# EasyEDA Pro project 无刷电机驱动_6-80V_20A_V2.0(无刷驱动板4T2用).eprj, board SNR8503M_BLDC_SNLS_6-80V_20A_V2.0-J
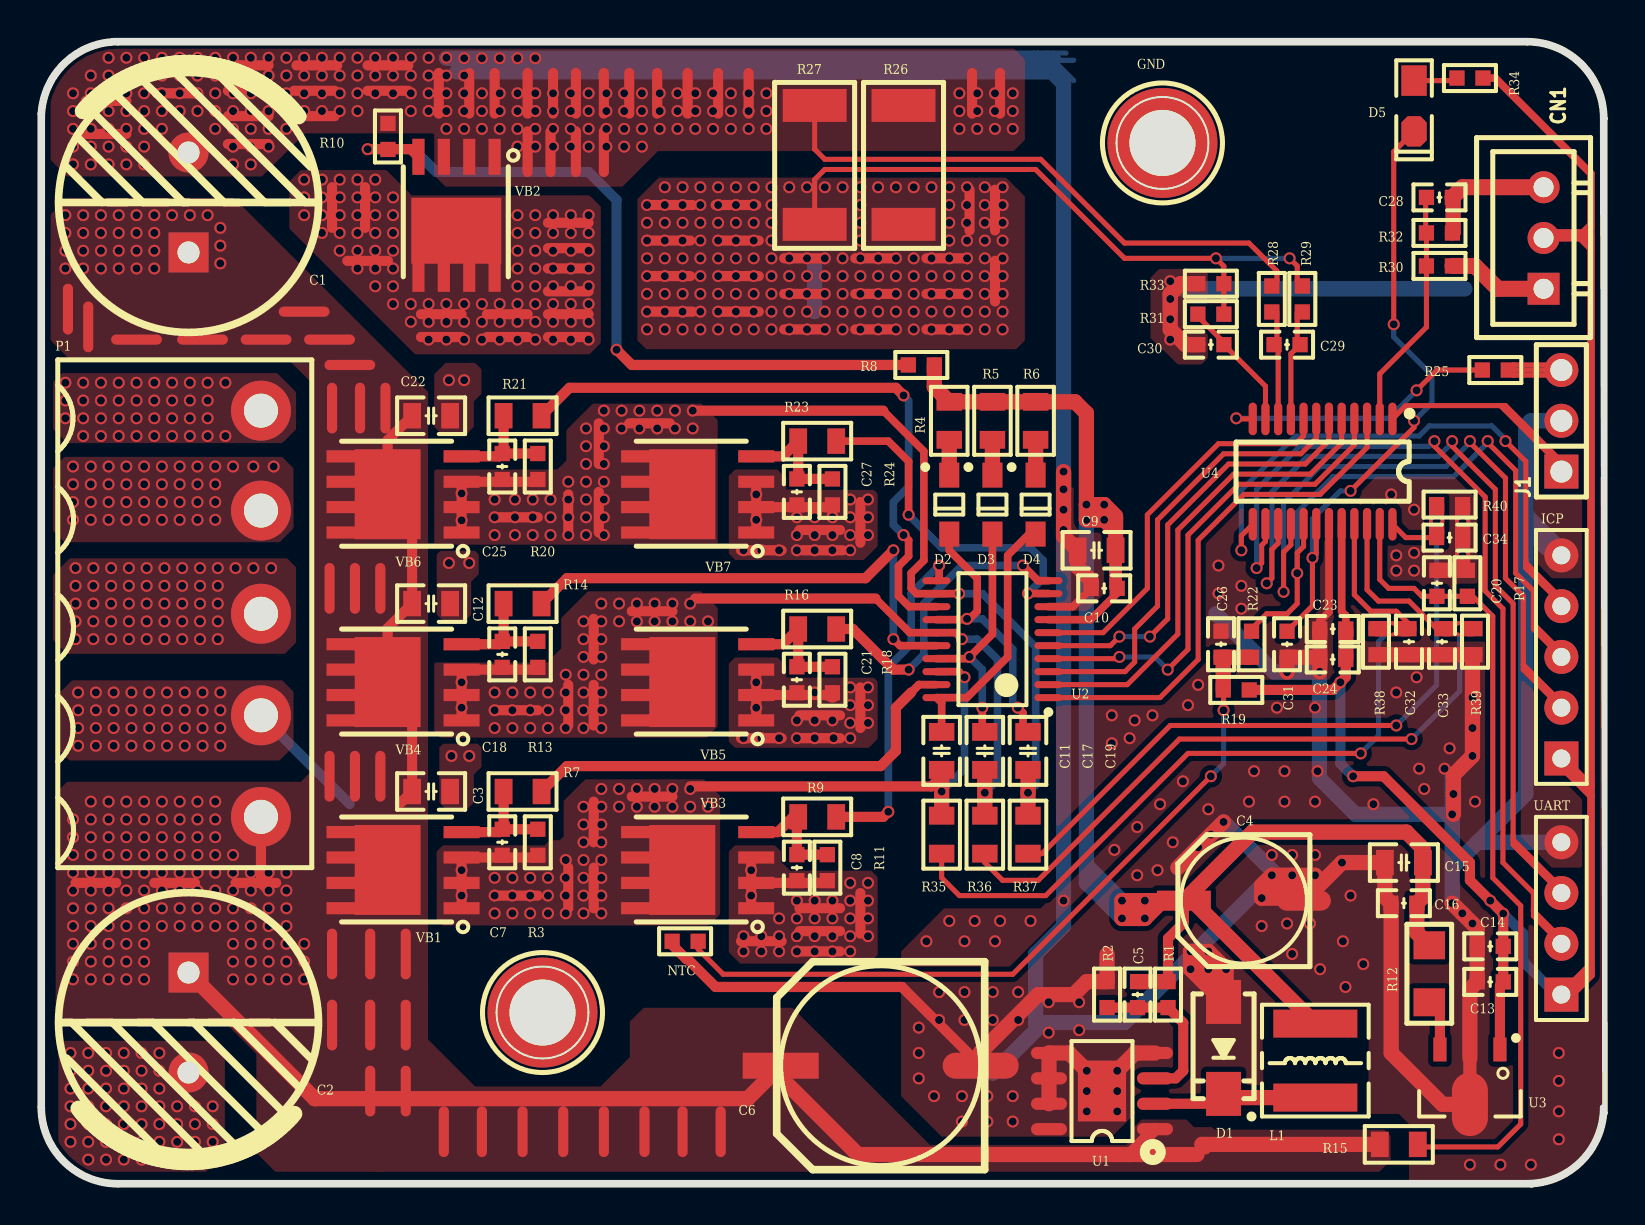
[diagram p0: board, top side]
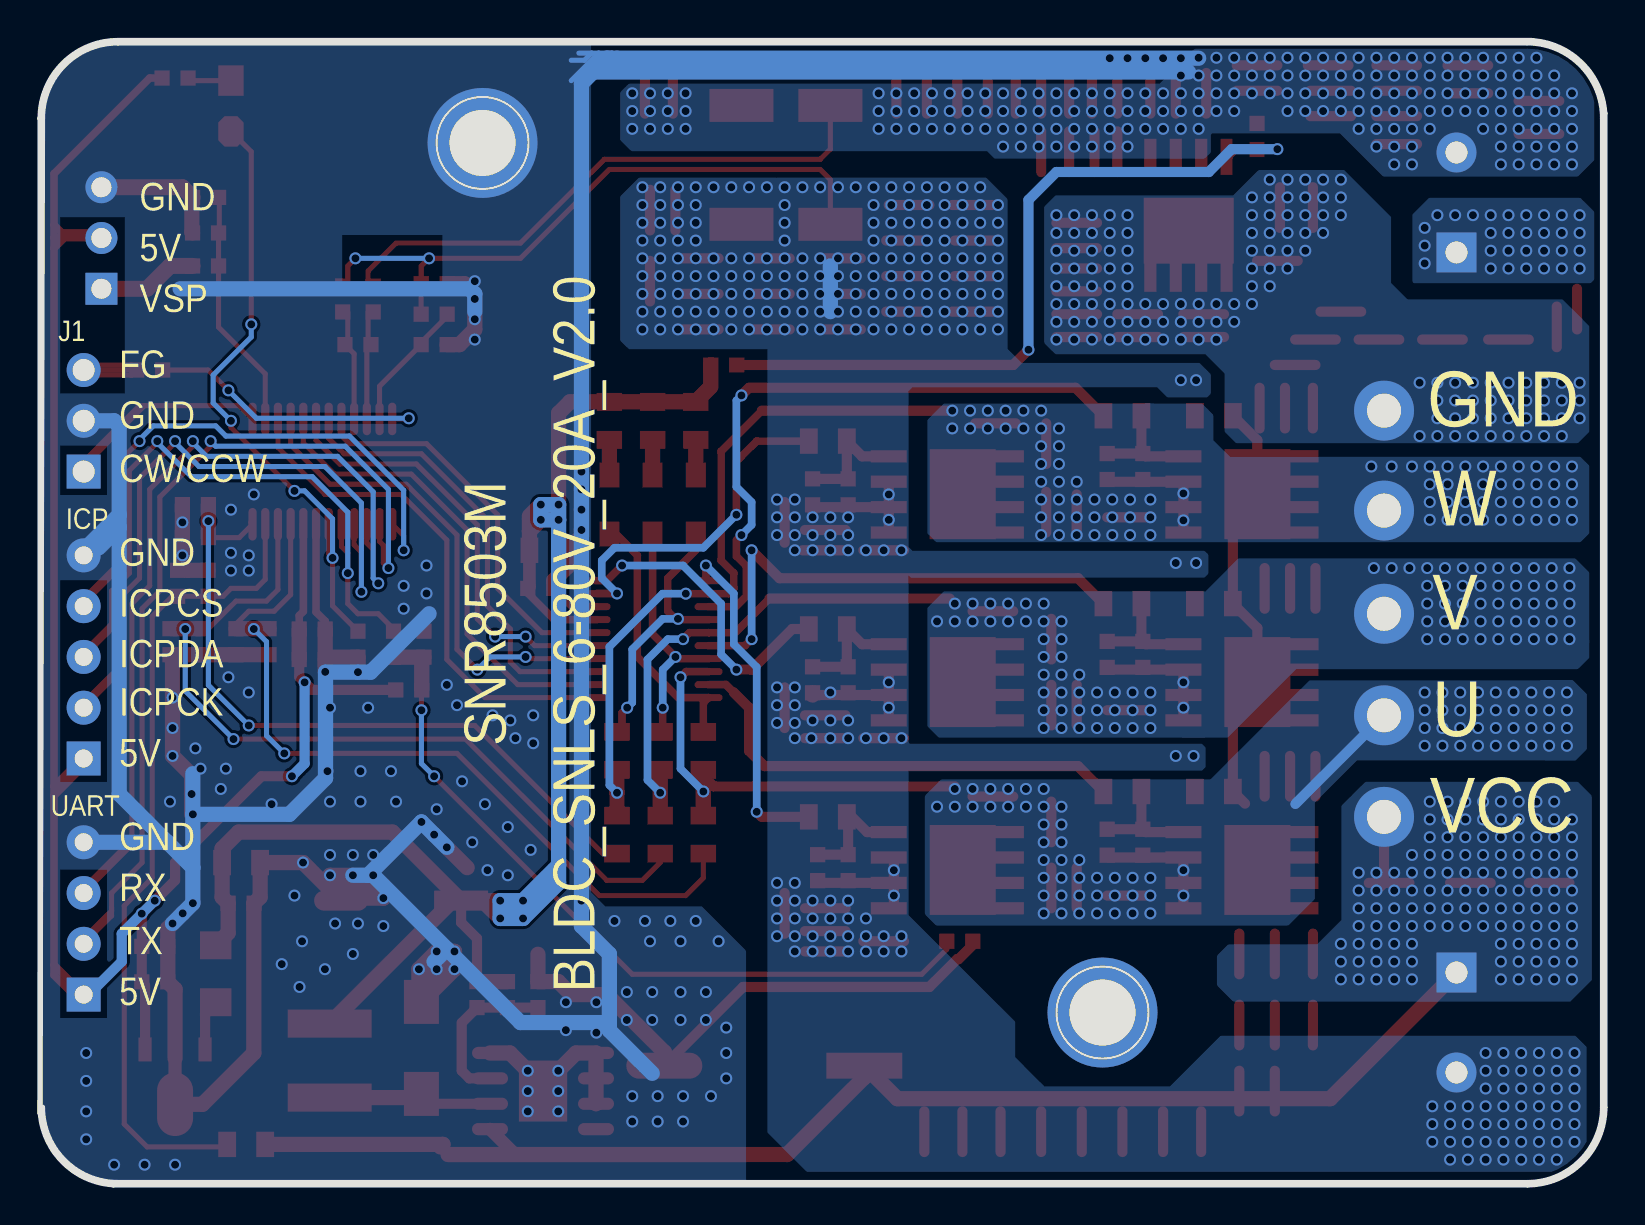
[diagram p1: board, bottom side, seen from below]

Outline 78.26 x 57.25 mm; copper layers: Top Layer, Bottom Layer. Coordinates in mm from the lower left corner of the outline.
Outline path: circle c25.13,8.63 r2.3 ; circle c56.13,52.13 r2.3 ; 74.57,0.13 3.89,0.13 arc(1.23,1.23) 0.13,3.89 0.13,53.36 arc(1.23,56.02) 3.89,57.13 74.36,57.13 arc(77.02,56.02) 78.13,53.36 78.25,3.61 ; 78.13,3.89 arc(77.02,1.23) 74.36,0.13 ; 78.25,53.35 arc(78.25,53.35) 78.25,53.34 ; 78.25,53.34 arc(78.26,53.35) 78.25,53.36 arc(77.11,56.11) 74.36,57.25 3.68,57.25 arc(3.66,57.25) 3.64,57.25 arc(1.15,56.12) 0.01,53.64 arc(0,53.62) 0,53.59 0,3.89 arc(1.14,1.14) 3.89,0 74.57,0 arc(74.6,0) 74.62,0.01 arc(77.08,1.11) 78.24,3.55 arc(78.25,3.58) 78.25,3.61 ; 78.25,53.34 78.25,3.61
Stack: Top Layer 0.0356mm / Dielectric1 0.32mm FR-4 er 4.8 / Bottom Layer 0.0356mm

## Design rules (mm)
net ICP: Inside Board Components
net R26: Inside Board Components
net R10: Inside Board Components
net R8: Inside Board Components
net R6: Inside Board Components
net R4: Inside Board Components
net D2: Inside Board Components
net C22: Inside Board Components
net C19: Inside Board Components
net C12: Inside Board Components
net VB7: Inside Board Components
net VB6: Inside Board Components
net VB5: Inside Board Components
net VB4: Inside Board Components
net VB3: Inside Board Components
net VB2: Inside Board Components
net VB1: Inside Board Components
net UART: Inside Board Components
net U4: Inside Board Components
net U3: Inside Board Components
net U1: Inside Board Components
net R40: Inside Board Components
net R39: Inside Board Components
net R38: Inside Board Components
net R37: Inside Board Components
net R36: Inside Board Components
net R35: Inside Board Components
net R34: Inside Board Components
net R33: Inside Board Components
net R32: Inside Board Components
net R31: Inside Board Components
net R30: Inside Board Components
net R29: Inside Board Components
net R28: Inside Board Components
net R27: Inside Board Components
net R25: Inside Board Components
net R24: Inside Board Components
net R23: Inside Board Components
net R22: Inside Board Components
net R21: Inside Board Components
net R20: Inside Board Components
net R19: Inside Board Components
net R18: Inside Board Components
net R17: Inside Board Components
net R16: Inside Board Components
net R15: Inside Board Components
net R14: Inside Board Components
net R13: Inside Board Components
net R12: Inside Board Components
net R11: Inside Board Components
net R9: Inside Board Components
net R5: Inside Board Components
net R7: Inside Board Components
net R3: Inside Board Components
net R2: Inside Board Components
net R1: Inside Board Components
net P1: Inside Board Components
net NTC: Inside Board Components
net L1: Inside Board Components
net J1: Inside Board Components
net HOLD1: Inside Board Components
net D5: Inside Board Components
net D1: Inside Board Components
net C34: Inside Board Components
net C33: Inside Board Components
net C32: Inside Board Components
net C31: Inside Board Components
net C30: Inside Board Components
net C29: Inside Board Components
net C28: Inside Board Components
net C27: Inside Board Components
net C26: Inside Board Components
net C25: Inside Board Components
net C24: Inside Board Components
net C23: Inside Board Components
net C21: Inside Board Components
net C20: Inside Board Components
net C18: Inside Board Components
net C16: Inside Board Components
net C15: Inside Board Components
net C14: Inside Board Components
net C13: Inside Board Components
net C11: Inside Board Components
net C8: Inside Board Components
net C7: Inside Board Components
net C10: Inside Board Components
net C6: Inside Board Components
net C5: Inside Board Components
net C4: Inside Board Components
net C3: Inside Board Components
net C2: Inside Board Components
net C1: Inside Board Components
net HOLD2: Inside Board Components
net C9: Inside Board Components
net C17: Inside Board Components
net D3: Inside Board Components
net D4: Inside Board Components
net U2: Inside Board Components
net Q3: SNR8503M_BLDC_SNLS_6-80V_20A_V2.0
net FB3: SNR8503M_BLDC_SNLS_6-80V_20A_V2.0
net P4: SNR8503M_BLDC_SNLS_6-80V_20A_V2.0
net P5: SNR8503M_BLDC_SNLS_6-80V_20A_V2.0
net Q1: SNR8503M_BLDC_SNLS_6-80V_20A_V2.0
net Q2: SNR8503M_BLDC_SNLS_6-80V_20A_V2.0
net Q4: SNR8503M_BLDC_SNLS_6-80V_20A_V2.0
net Q5: SNR8503M_BLDC_SNLS_6-80V_20A_V2.0
net R43: SNR8503M_BLDC_SNLS_6-80V_20A_V2.0
net R44: SNR8503M_BLDC_SNLS_6-80V_20A_V2.0
net USR1: SNR8503M_BLDC_SNLS_6-80V_20A_V2.0
net R45: SNR8503M_BLDC_SNLS_6-80V_20A_V2.0
net C35: SNR8503M_BLDC_SNLS_6-80V_20A_V2.0
net U5: SNR8503M_BLDC_SNLS_6-80V_20A_V2.0
net SWD: SNR8503M_BLDC_SNLS_6-80V_20A_V2.0
net PG: SNR8503M_BLDC_SNLS_6-80V_20A_V2.0
template: 用户自定义配置
spacing Clearance (default): track to track 0.254, other pairs 0 to 0.254
track width Width (default): min 0.254, default 0.3, max 100
differential pair DiffPairsRouting (default): width min 0.381, default 0.381, max 0.381; gap min 0.254, default 0.701
via RoutingVias (default): diameter min 0.254, default 1.27, max 2.54; hole min 0.254, default 0.711, max 2.54

## Placement (name value [footprint] x y rotation side)
C1  220uF/100V  [CAP 5.0*12.5*20]  7.43 49.15 90 top
C2  220uF/100V  [CAP 5.0*12.5*20]  7.43 8.13 270 top
C3  0.1uF/100V/0805  [C 0805_L]  19.56 19.69 180 top
C4  100uF/35V  [CM D(6.3*7.7)]  60.2 14.22 180 top
C5  33nF/50V  [C 0603_L]  54.88 9.53 90 top
C6  33uF/100V  [CM F(10*10.2)]  42.04 5.97 180 top
C7  1nF/50V  [C 0603_L]  23.11 17.15 90 top
C8  1nF/50V  [C 0603_L]  37.85 15.88 90 top
C9  10uF/25V/0805  [C 0805_L]  52.83 31.75 0 top
C10  0.1uF/50V  [C 0603_L]  53.21 29.85 0 top
C11  10uF/25V/0805  [C 0805_L]  45.09 21.72 270 top
C12  0.1uF/100V/0805  [C 0805_L]  19.56 29.08 180 top
C13  10uF/10V  [C 0603_L]  72.52 10.16 0 top
C14  0.1uF/50V  [C 0603_L]  72.52 11.94 0 top
C15  10uF/25V/0805  [C 0805_L]  68.2 16.13 0 top
C16  0.1uF/50V  [C 0603_L]  68.2 14.1 0 top
C17  10uF/25V/0805  [C 0805_L]  47.24 21.72 270 top
C18  1nF/50V  [C 0603_L]  23.11 26.54 90 top
C19  10uF/25V/0805  [C 0805_L]  49.4 21.72 270 top
C20  0.1uF/50V  [C 0603_L]  69.85 30.1 270 top
C21  1nF/50V  [C 0603_L]  37.85 25.27 90 top
C22  0.1uF/100V/0805  [C 0805_L]  19.56 38.48 180 top
C23  0.1uF/50V  [C 0603_L]  64.64 27.81 0 top
C24  10uF/10V  [C 0603_L]  64.64 26.29 0 top
C25  1nF/50V  [C 0603_L]  23.11 35.94 90 top
C26  0.1uF/50V  [C 0603_L]  59.06 27.05 270 top
C27  1nF/50V  [C 0603_L]  37.85 34.67 90 top
C28  10uF/10V  [C 0603_L]  69.98 49.4 180 top
C29  1uF/16V  [C 0603_L]  62.36 42.04 180 top
C30  1nF/50V  [C 0603_L]  58.55 42.04 0 top
C31  0.1uF/50V  [C 0603_L]  62.36 27.05 90 top
C32  1nF/50V  [C 0603_L]  68.45 27.18 90 top
C33  1nF/50V  [C 0603_L]  70.1 27.18 90 top
C34  1nF/50V  [C 0603_L]  70.49 32.39 180 top
CN1  ZX-XH2.54-3PZZ  [CONN-TH_3P-P2.54_2501S-3P]  75.18 47.37 90 top
D1  SS210  [SMA]  59.18 6.86 270 top
D2  US1M  [SOD-123]  45.47 34.04 90 top
D3  US1M  [SOD-123]  47.63 34.04 90 top
D4  US1M  [SOD-123]  49.78 34.04 90 top
D5  LED0  [LED 0805R]  68.71 53.98 270 top
HOLD1  TEST POINT  [HOLD330-600]  25.13 8.63 0 top
HOLD2  TEST POINT  [HOLD330-600]  56.13 52.13 0 top
ICP  ICP  [HDR2.54-LI-5P]  76.07 26.42 90 top
J1  PZ254V-11-03P  [HDR-TH_3P-P2.54-V-M]  76.07 38.23 90 top
L1  100uH/500mA  [NR5020]  63.77 6.22 90 top
NOREF  -  [Pad_ie222]  26.42 24 0 top
NOREF#2  -  [Pad_ie114]  39.12 31.75 90 top
NOREF#3  -  [Pad_ie116]  34.04 2.67 180 top
NOREF#4  -  [Pad_ie176]  35.43 54.61 0 top
NOREF#5  -  [Pad_ie181]  45.34 42.8 90 top
NOREF#6  -  [Pad_ie169]  26.8 51.69 0 top
NOREF#7  -  [Pad_ie188]  38.23 44.58 90 top
NOREF#8  -  [Pad_ie195]  31.5 45.47 270 top
NOREF#9  -  [Pad_ie178]  48.01 54.61 0 top
NOREF#10  -  [Pad_ie214]  30.61 19.43 270 top
NOREF#11  -  [Pad_ie200]  27.94 33.66 0 top
NOREF#12  -  [Pad_ie229]  17.02 20.45 0 top
NOREF#13  -  [Pad_ie224]  14.48 29.85 0 top
NOREF#14  -  [Pad_ie219]  30.61 28.7 90 top
NOREF#15  -  [Pad_ie187]  38.23 42.8 90 top
NOREF#16  -  [Pad_ie104]  36.07 12.19 90 top
NOREF#17  -  [Pad_ie140]  26.42 43.56 90 top
NOREF#18  -  [Pad_ie106]  38.99 12.7 90 top
NOREF#19  -  [Pad_ie134]  2.79 15.11 90 top
NOREF#20  -  [Pad_ie150]  6.86 54.61 270 top
NOREF#21  -  [Pad_ie227]  14.48 20.45 0 top
NOREF#22  -  [Pad_ie151]  6.86 56.01 270 top
NOREF#23  -  [Pad_ie180]  47.75 48.77 180 top
NOREF#24  -  [Pad_ie115]  38.99 32.77 90 top
NOREF#25  -  [Pad_ie209]  14.48 42.29 90 top
NOREF#26  -  [Pad_ie177]  46.61 54.61 0 top
NOREF#27  -  [Pad_ie144]  20.07 43.56 270 top
NOREF#28  -  [Pad_ie166]  24.38 51.69 0 top
NOREF#29  -  [Pad_ie226]  17.02 29.85 0 top
NOREF#30  -  [Pad_ie208]  11.3 42.29 90 top
NOREF#31  -  [Pad_ie228]  15.75 20.45 0 top
NOREF#32  -  [Pad_ie121]  24.13 2.67 180 top
NOREF#33  -  [Pad_ie172]  29.46 54.61 0 top
NOREF#34  -  [Pad_ie159]  17.4 54.74 90 top
NOREF#35  -  [Pad_ie124]  18.29 4.7 180 top
NOREF#36  -  [Pad_ie131]  14.61 11.56 180 top
NOREF#37  -  [Pad_ie137]  26.42 45.85 90 top
NOREF#38  -  [Pad_ie154]  10.41 52.07 270 top
NOREF#39  -  [Pad_ie171]  28.19 54.61 0 top
NOREF#40  -  [Pad_ie217]  26.42 14.86 180 top
NOREF#41  -  [Pad_ie143]  23.37 43.56 270 top
NOREF#42  -  [Pad_ie139]  26.42 42.42 90 top
NOREF#43  -  [Pad_ie122]  22.1 2.67 180 top
NOREF#44  -  [Pad_ie191]  34.93 43.69 270 top
NOREF#45  -  [Pad_ie136]  26.42 46.86 90 top
NOREF#46  -  [Pad_ie206]  4.83 42.29 90 top
NOREF#47  -  [Pad_ie179]  47.75 45.21 180 top
NOREF#48  -  [Pad_ie148]  3.3 52.58 270 top
NOREF#49  -  [Pad_ie164]  24.38 54.61 0 top
NOREF#50  -  [Pad_ie225]  15.75 29.85 0 top
NOREF#51  -  [Pad_ie175]  33.91 54.61 0 top
NOREF#52  -  [Pad_ie117]  32.13 2.67 180 top
NOREF#53  -  [Pad_ie167]  25.53 51.69 0 top
NOREF#54  -  [Pad_ie162]  21.46 54.61 0 top
NOREF#55  -  [Pad_ie160]  17.4 56.01 90 top
NOREF#56  -  [Pad_ie132]  10.8 15.11 90 top
NOREF#57  -  [Pad_ie105]  38.99 11.68 90 top
NOREF#58  -  [Pad_ie182]  45.34 44.58 90 top
NOREF#59  -  [Pad_ie156]  13.72 53.47 90 top
NOREF#60  -  [Pad_ie126]  18.29 8 180 top
NOREF#61  -  [Pad_ie186]  41.78 46.36 90 top
NOREF#62  -  [Pad_ie118]  30.23 2.67 180 top
NOREF#63  -  [Pad_ie127]  16.51 8 180 top
NOREF#64  -  [Pad_ie102]  46.48 48.77 0 top
NOREF#65  -  [Pad_ie141]  23.37 42.42 270 top
NOREF#66  -  [Pad_ie220]  27.69 27.31 0 top
NOREF#67  -  [Pad_ie145]  16.38 46.23 270 top
NOREF#68  -  [Pad_ie213]  14.61 38.86 0 top
NOREF#69  -  [Pad_ie152]  10.41 56.01 270 top
NOREF#70  -  [Pad_ie155]  10.41 53.47 270 top
NOREF#71  -  [Pad_ie147]  14.61 48.9 180 top
NOREF#72  -  [Pad_ie108]  41.02 23.88 0 top
NOREF#73  -  [Pad_ie168]  26.8 54.61 0 top
NOREF#74  -  [Pad_ie196]  31.5 47.24 270 top
NOREF#75  -  [Pad_ie165]  25.65 54.61 0 top
NOREF#76  -  [Pad_ie201]  26.42 33.53 0 top
NOREF#77  -  [Pad_ie119]  28.19 2.67 180 top
NOREF#78  -  [Pad_ie138]  26.42 44.7 90 top
NOREF#79  -  [Pad_ie192]  34.93 45.47 270 top
NOREF#80  -  [Pad_ie190]  31.62 49.02 270 top
NOREF#81  -  [Pad_ie153]  10.41 54.74 270 top
NOREF#82  -  [Pad_ie184]  41.78 42.8 90 top
NOREF#83  -  [Pad_ie135]  26.42 48.13 90 top
NOREF#84  -  [Pad_ie128]  14.61 8 180 top
NOREF#85  -  [Pad_ie199]  27.94 37.08 0 top
NOREF#86  -  [Pad_ie142]  20.07 42.42 270 top
NOREF#87  -  [Pad_ie170]  28.19 51.69 0 top
NOREF#88  -  [Pad_ie161]  19.94 54.61 0 top
NOREF#89  -  [Pad_ie216]  27.69 14.86 180 top
NOREF#90  -  [Pad_ie185]  41.78 44.58 90 top
NOREF#91  -  [Pad_ie198]  30.48 38.1 90 top
NOREF#92  -  [Pad_ie113]  36.07 31.75 90 top
NOREF#93  -  [Pad_ie204]  2.41 42.93 180 top
NOREF#94  -  [Pad_ie163]  22.73 54.61 0 top
NOREF#95  -  [Pad_ie205]  1.4 43.82 180 top
NOREF#96  -  [Pad_ie130]  16.51 11.56 180 top
NOREF#97  -  [Pad_ie193]  34.93 47.24 270 top
NOREF#98  -  [Pad_ie218]  23.88 14.48 90 top
NOREF#99  -  [Pad_ie109]  36.07 22.35 270 top
NOREF#100  -  [Pad_ie202]  23.88 33.4 270 top
NOREF#101  -  [Pad_ie194]  31.62 43.69 270 top
NOREF#102  -  [Pad_ie183]  45.34 46.36 90 top
NOREF#103  -  [Pad_ie123]  20.19 2.67 180 top
NOREF#104  -  [Pad_ie223]  23.88 23.75 270 top
NOREF#105  -  [Pad_ie110]  38.99 22.35 270 top
NOREF#106  -  [Pad_ie174]  32.39 54.61 0 top
NOREF#107  -  [Pad_ie112]  41.02 33.15 180 top
NOREF#108  -  [Pad_ie149]  3.3 54.23 270 top
NOREF#109  -  [Pad_ie129]  18.29 11.56 180 top
NOREF#110  -  [Pad_ie107]  38.99 13.84 90 top
NOREF#111  -  [Pad_ie158]  13.72 54.74 90 top
NOREF#112  -  [Pad_ie173]  30.86 54.61 0 top
NOREF#113  -  [Pad_ie203]  13.21 43.69 270 top
NOREF#114  -  [Pad_ie210]  15.49 41.02 90 top
NOREF#115  -  [Pad_ie197]  34.8 49.02 270 top
NOREF#116  -  [Pad_ie211]  17.27 38.86 0 top
NOREF#117  -  [Pad_ie189]  38.23 46.36 90 top
NOREF#118  -  [Pad_ie221]  27.69 24 0 top
NOREF#119  -  [Pad_ie215]  27.69 18.16 180 top
NOREF#120  -  [Pad_ie157]  13.84 56.01 90 top
NOREF#121  -  [Pad_ie133]  6.73 15.11 90 top
NOREF#122  -  [Pad_ie146]  16.26 48.9 180 top
NOREF#123  -  [Pad_ie120]  26.16 2.67 180 top
NOREF#124  -  [Pad_ie125]  16.51 4.7 180 top
NOREF#125  -  [Pad_ie212]  16 38.86 0 top
NOREF#126  -  [Pad_ie111]  38.99 23.5 270 top
NOREF#127  -  [Pad_ie207]  8.13 42.29 90 top
NOREF#128  -  [Pad_ie103]  41.02 13.59 180 top
NTC  10K/3950  [R 0603_L]  32.26 12.19 0 top
P1  P1  [CONN-TH-5.08-5P]  11.05 28.58 270 top
R1  30K/1%  [R 0603_L]  56.41 9.53 270 top
R2  2.7K/1%  [R 0603_L]  53.36 9.53 90 top
R3  20K/1%  [R 0603_L]  24.89 17.15 270 top
R4  10R/0805  [R 0805_L]  45.47 38.23 270 top
R5  10R/0805  [R 0805_L]  47.63 38.23 270 top
R6  10R/0805  [R 0805_L]  49.78 38.23 270 top
R7  10R/0805  [R 0805_L]  24.13 19.69 0 top
R8  1K/1%  [R 0603_L]  44.07 41.02 0 top
R9  10R/0805  [R 0805_L]  38.86 18.42 0 top
R10  10K/1%  [R 0603_L]  17.4 52.45 270 top
R11  20K/1%  [R 0603_L]  39.37 15.88 270 top
R12  10R/1206  [R 1206_L]  69.47 10.54 90 top
R13  20K/1%  [R 0603_L]  24.89 26.54 270 top
R14  10R/0805  [R 0805_L]  24.13 29.08 0 top
R15  33K/0805/1%  [R 0805_L]  67.95 2.03 180 top
R16  10R/0805  [R 0805_L]  38.86 27.81 0 top
R17  1K/1%  [R 0603_L]  71.37 30.1 270 top
R18  20K/1%  [R 0603_L]  39.62 25.27 270 top
R19  10K/1%  [R 0603_L]  59.82 24.77 0 top
R20  20K/1%  [R 0603_L]  24.89 35.94 270 top
R21  10R/0805  [R 0805_L]  24.13 38.48 0 top
R22  10K/1%  [R 0603_L]  60.58 27.05 90 top
R23  10R/0805  [R 0805_L]  38.86 37.21 0 top
R24  20K/1%  [R 0603_L]  39.62 34.67 270 top
R25  1K/1%  [R 0603_L]  72.77 40.77 0 top
R26  NC  [R 2512_L]  43.18 51.05 270 top
R27  0.004R/2512/2W  [R 2512_L]  38.74 51.05 270 top
R28  1K/1%  [R 0603_L]  61.6 44.32 270 top
R29  1K/1%  [R 0603_L]  63.12 44.32 270 top
R30  10K/1%  [R 0603_L]  69.98 45.97 0 top
R31  1K/1%  [R 0603_L]  58.55 43.56 0 top
R32  20K/1%  [R 0603_L]  69.98 47.63 0 top
R33  10R/1%  [R 0603_L]  58.55 45.09 180 top
R34  1K/1%  [R 0603_L]  71.5 55.37 0 top
R35  33K/0805/1%  [R 0805_L]  45.09 17.53 270 top
R36  33K/0805/1%  [R 0805_L]  47.24 17.53 270 top
R37  33K/0805/1%  [R 0805_L]  49.4 17.53 270 top
R38  1K/1%  [R 0603_L]  66.8 27.18 270 top
R39  1K/1%  [R 0603_L]  71.76 27.18 270 top
R40  1K/1%  [R 0603_L]  70.49 34.04 0 top
U1  TPS750D  [SOIC-8_EP]  53.1 4.7 180 top
U2  SNR2134G/20TSSOP  [TSSOP20_L]  47.63 27.31 180 top
U3  78L05  [SOT89_L]  71.5 6.48 180 top
U4  SNR8503M  [SSOP-24_150mil]  64.14 35.69 180 top
UART  UART  [HDR2.54-LI-4P]  76.07 13.34 90 top
VB1  TPS85N95M/DFN5X6  [DFN5x6-8L_TPS]  21.08 13.84 180 top
VB2  TPS85N95M/DFN5X6  [DFN5x6-8L_TPS]  22.73 51.44 270 top
VB3  TPS85N95M/DFN5X6  [DFN5x6-8L_TPS]  35.81 13.84 180 top
VB4  TPS85N95M/DFN5X6  [DFN5x6-8L_TPS]  21.08 23.24 180 top
VB5  TPS85N95M/DFN5X6  [DFN5x6-8L_TPS]  35.81 23.24 180 top
VB6  TPS85N95M/DFN5X6  [DFN5x6-8L_TPS]  21.08 32.64 180 top
VB7  TPS85N95M/DFN5X6  [DFN5x6-8L_TPS]  35.81 32.64 180 top

## Footprints (pads in the part's own frame, mm; a bottom-side part is the same pattern mirrored in y, then rotated)
C 0603_L
  rect 0.762x0.762 smd: 1(-0.65,0) 2(0.65,0)
C 0805_L
  rect 0.889x1.27 smd: 1(-0.95,0) 2(0.95,0)
CAP 5.0*12.5*20
  rect 2x2 hole 1.1: 1(-2.5,0)
  round 2 hole 1.1: 2(2.5,0)
CM D(6.3*7.7)
  rect 2.7x1 smd: 1(3,0)
  oval 2.7x1 smd: 2(-3,0)
CM F(10*10.2)
  rect 3.8x1.3 smd: 1(5,0)
  oval 3.8x1.3 smd: 2(-5,0)
CONN-TH-5.08-5P
  round 2.999 hole 1.7: 1(-10.16,0) 2(-5.162,0) 3(0,0) 4(5.08,0) 5(10.16,0)
CONN-TH_3P-P2.54_2501S-3P
  rect 1.6x1.6 hole 1: 1(-2.54,0)
  round 1.6 hole 1: 2(0,0) 3(2.54,0)
DFN5x6-8L_TPS
  rect 1.8x0.61 smd: 1(0,0) 2(0,-1.27) 3(0,-2.54) 4(0,-3.81) 5(5.858,-3.81) 6(5.858,-2.54) 7(5.858,-1.27) 8(5.858,0)
  rect 3.3x4.5 smd: 5(3.698,-1.917)
HDR2.54-LI-4P
  rect 1.7x1.7 hole 0.9: 1(-3.81,0)
  round 1.7 hole 0.9: 2(-1.27,0) 3(1.27,0) 4(3.81,0)
HDR2.54-LI-5P
  rect 1.7x1.7 hole 0.9: 1(-5.08,0)
  round 1.7 hole 0.9: 2(-2.54,0) 3(0,0) 4(2.54,0) 5(5.08,0)
HDR-TH_3P-P2.54-V-M
  rect 1.7x1.7 hole 1.1x0.9: 1(-2.54,0)
  round 1.7 hole 1.1x0.9: 2(0,0) 3(2.54,0)
HOLD330-600
  round 5.5 hole 3.302: 0(0,0)
LED 0805R
  rect 1.524x1.27 smd: 1(-1.27,0)
  custom 1.524x1.27 smd: 2(1.27,0)
NR5020
  rect 1.4x4.2 smd: 1(-1.85,0) 2(1.85,0)
Pad_ie102
  oval 0.508x2.54 smd: 0(0,0)
Pad_ie103
  oval 0.508x2.54 smd: 0(0,0)
Pad_ie104
  oval 0.508x2.54 smd: 0(0,0)
Pad_ie105
  oval 0.508x2.54 smd: 0(0,0)
Pad_ie106
  oval 0.508x2.54 smd: 0(0,0)
Pad_ie107
  oval 0.508x2.54 smd: 0(0,0)
Pad_ie108
  oval 0.508x2.54 smd: 0(0,0)
Pad_ie109
  oval 0.508x2.54 smd: 0(0,0)
Pad_ie110
  oval 0.508x2.54 smd: 0(0,0)
Pad_ie111
  oval 0.508x2.54 smd: 0(0,0)
Pad_ie112
  oval 0.508x2.54 smd: 0(0,0)
Pad_ie113
  oval 0.508x2.54 smd: 0(0,0)
Pad_ie114
  oval 0.508x2.54 smd: 0(0,0)
Pad_ie115
  oval 0.508x2.54 smd: 0(0,0)
Pad_ie116
  oval 0.508x2.54 smd: 0(0,0)
Pad_ie117
  oval 0.508x2.54 smd: 0(0,0)
Pad_ie118
  oval 0.508x2.54 smd: 0(0,0)
Pad_ie119
  oval 0.508x2.54 smd: 0(0,0)
Pad_ie120
  oval 0.508x2.54 smd: 0(0,0)
Pad_ie121
  oval 0.508x2.54 smd: 0(0,0)
Pad_ie122
  oval 0.508x2.54 smd: 0(0,0)
Pad_ie123
  oval 0.508x2.54 smd: 0(0,0)
Pad_ie124
  oval 0.508x2.54 smd: 0(0,0)
Pad_ie125
  oval 0.508x2.54 smd: 0(0,0)
Pad_ie126
  oval 0.508x2.54 smd: 0(0,0)
Pad_ie127
  oval 0.508x2.54 smd: 0(0,0)
Pad_ie128
  oval 0.508x2.54 smd: 0(0,0)
Pad_ie129
  oval 0.508x2.54 smd: 0(0,0)
Pad_ie130
  oval 0.508x2.54 smd: 0(0,0)
Pad_ie131
  oval 0.508x2.54 smd: 0(0,0)
Pad_ie132
  oval 0.508x2.54 smd: 0(0,0)
Pad_ie133
  oval 0.508x2.54 smd: 0(0,0)
Pad_ie134
  oval 0.508x2.54 smd: 0(0,0)
Pad_ie135
  oval 0.508x2.54 smd: 0(0,0)
Pad_ie136
  oval 0.508x2.54 smd: 0(0,0)
Pad_ie137
  oval 0.508x2.54 smd: 0(0,0)
Pad_ie138
  oval 0.508x2.54 smd: 0(0,0)
Pad_ie139
  oval 0.508x2.54 smd: 0(0,0)
Pad_ie140
  oval 0.508x2.54 smd: 0(0,0)
Pad_ie141
  oval 0.508x2.54 smd: 0(0,0)
Pad_ie142
  oval 0.508x2.54 smd: 0(0,0)
Pad_ie143
  oval 0.508x2.54 smd: 0(0,0)
Pad_ie144
  oval 0.508x2.54 smd: 0(0,0)
Pad_ie145
  oval 0.508x2.54 smd: 0(0,0)
Pad_ie146
  oval 0.508x2.54 smd: 0(0,0)
Pad_ie147
  oval 0.508x2.54 smd: 0(0,0)
Pad_ie148
  oval 0.508x2.54 smd: 0(0,0)
Pad_ie149
  oval 0.508x2.54 smd: 0(0,0)
Pad_ie150
  oval 0.508x2.54 smd: 0(0,0)
Pad_ie151
  oval 0.508x2.54 smd: 0(0,0)
Pad_ie152
  oval 0.508x2.54 smd: 0(0,0)
Pad_ie153
  oval 0.508x2.54 smd: 0(0,0)
Pad_ie154
  oval 0.508x2.54 smd: 0(0,0)
Pad_ie155
  oval 0.508x2.54 smd: 0(0,0)
Pad_ie156
  oval 0.508x2.54 smd: 0(0,0)
Pad_ie157
  oval 0.508x2.54 smd: 0(0,0)
Pad_ie158
  oval 0.508x2.54 smd: 0(0,0)
Pad_ie159
  oval 0.508x2.54 smd: 0(0,0)
Pad_ie160
  oval 0.508x2.54 smd: 0(0,0)
Pad_ie161
  oval 0.508x2.54 smd: 0(0,0)
Pad_ie162
  oval 0.508x2.54 smd: 0(0,0)
Pad_ie163
  oval 0.508x2.54 smd: 0(0,0)
Pad_ie164
  oval 0.508x2.54 smd: 0(0,0)
Pad_ie165
  oval 0.508x2.54 smd: 0(0,0)
Pad_ie166
  oval 0.508x2.54 smd: 0(0,0)
Pad_ie167
  oval 0.508x2.54 smd: 0(0,0)
Pad_ie168
  oval 0.508x2.54 smd: 0(0,0)
Pad_ie169
  oval 0.508x2.54 smd: 0(0,0)
Pad_ie170
  oval 0.508x2.54 smd: 0(0,0)
Pad_ie171
  oval 0.508x2.54 smd: 0(0,0)
Pad_ie172
  oval 0.508x2.54 smd: 0(0,0)
Pad_ie173
  oval 0.508x2.54 smd: 0(0,0)
Pad_ie174
  oval 0.508x2.54 smd: 0(0,0)
Pad_ie175
  oval 0.508x2.54 smd: 0(0,0)
Pad_ie176
  oval 0.508x2.54 smd: 0(0,0)
Pad_ie177
  oval 0.508x2.54 smd: 0(0,0)
Pad_ie178
  oval 0.508x2.54 smd: 0(0,0)
Pad_ie179
  oval 0.508x2.54 smd: 0(0,0)
Pad_ie180
  oval 0.508x2.54 smd: 0(0,0)
Pad_ie181
  oval 0.508x2.54 smd: 0(0,0)
Pad_ie182
  oval 0.508x2.54 smd: 0(0,0)
Pad_ie183
  oval 0.508x2.54 smd: 0(0,0)
Pad_ie184
  oval 0.508x2.54 smd: 0(0,0)
Pad_ie185
  oval 0.508x2.54 smd: 0(0,0)
Pad_ie186
  oval 0.508x2.54 smd: 0(0,0)
Pad_ie187
  oval 0.508x2.54 smd: 0(0,0)
Pad_ie188
  oval 0.508x2.54 smd: 0(0,0)
Pad_ie189
  oval 0.508x2.54 smd: 0(0,0)
Pad_ie190
  oval 0.508x2.54 smd: 0(0,0)
Pad_ie191
  oval 0.508x2.54 smd: 0(0,0)
Pad_ie192
  oval 0.508x2.54 smd: 0(0,0)
Pad_ie193
  oval 0.508x2.54 smd: 0(0,0)
Pad_ie194
  oval 0.508x2.54 smd: 0(0,0)
Pad_ie195
  oval 0.508x2.54 smd: 0(0,0)
Pad_ie196
  oval 0.508x2.54 smd: 0(0,0)
Pad_ie197
  oval 0.508x2.54 smd: 0(0,0)
Pad_ie198
  oval 0.508x2.54 smd: 0(0,0)
Pad_ie199
  oval 0.508x2.54 smd: 0(0,0)
Pad_ie200
  oval 0.508x2.54 smd: 0(0,0)
Pad_ie201
  oval 0.508x2.54 smd: 0(0,0)
Pad_ie202
  oval 0.508x2.54 smd: 0(0,0)
Pad_ie203
  oval 0.508x2.54 smd: 0(0,0)
Pad_ie204
  oval 0.508x2.54 smd: 0(0,0)
Pad_ie205
  oval 0.508x2.54 smd: 0(0,0)
Pad_ie206
  oval 0.508x2.54 smd: 0(0,0)
Pad_ie207
  oval 0.508x2.54 smd: 0(0,0)
Pad_ie208
  oval 0.508x2.54 smd: 0(0,0)
Pad_ie209
  oval 0.508x2.54 smd: 0(0,0)
Pad_ie210
  oval 0.508x2.54 smd: 0(0,0)
Pad_ie211
  oval 0.508x2.54 smd: 0(0,0)
Pad_ie212
  oval 0.508x2.54 smd: 0(0,0)
Pad_ie213
  oval 0.508x2.54 smd: 0(0,0)
Pad_ie214
  oval 0.508x2.54 smd: 0(0,0)
Pad_ie215
  oval 0.508x2.54 smd: 0(0,0)
Pad_ie216
  oval 0.508x2.54 smd: 0(0,0)
Pad_ie217
  oval 0.508x2.54 smd: 0(0,0)
Pad_ie218
  oval 0.508x2.54 smd: 0(0,0)
Pad_ie219
  oval 0.508x2.54 smd: 0(0,0)
Pad_ie220
  oval 0.508x2.54 smd: 0(0,0)
Pad_ie221
  oval 0.508x2.54 smd: 0(0,0)
Pad_ie222
  oval 0.508x2.54 smd: 0(0,0)
Pad_ie223
  oval 0.508x2.54 smd: 0(0,0)
Pad_ie224
  oval 0.508x2.54 smd: 0(0,0)
Pad_ie225
  oval 0.508x2.54 smd: 0(0,0)
Pad_ie226
  oval 0.508x2.54 smd: 0(0,0)
Pad_ie227
  oval 0.508x2.54 smd: 0(0,0)
Pad_ie228
  oval 0.508x2.54 smd: 0(0,0)
Pad_ie229
  oval 0.508x2.54 smd: 0(0,0)
R 0603_L
  rect 0.762x0.762 smd: 1(-0.65,0) 2(0.65,0)
R 0805_L
  rect 0.889x1.27 smd: 1(-0.95,0) 2(0.95,0)
R 1206_L
  rect 1.397x1.575 smd: 1(-1.4,0) 2(1.45,0)
R 2512_L
  rect 1.65x3.2 smd: 1(-2.95,0) 2(3,0)
SMA
  rect 2.2x1.75 smd: 1(-2.3,0) 2(2.3,0)
SOD-123
  rect 1.25x1 smd: 1(1.475,0) 2(-1.475,0)
SOIC-8_EP
  oval 1.8x0.61 smd: 1(-2.65,1.905) 2(-2.65,0.635) 3(-2.65,-0.635) 4(-2.65,-1.905) 5(2.65,-1.905) 6(2.65,-0.635) 7(2.65,0.635) 8(2.65,1.905)
  rect 2.413x3.048 smd: 9(0,0)
SOT89_L
  rect 0.66x1.2 smd: 1(-1.5,-0.303) 3(1.5,-0.303)
  oval 1.8x3.175 smd: 2(0,2.441)
  rect 0.66x2.1 smd: 2(0,0.127)
SSOP-24_150mil
  oval 0.41x1.63 smd: 1(-3.493,-2.635) 2(-2.857,-2.635) 3(-2.223,-2.635) 4(-1.587,-2.635) 5(-0.953,-2.635) 6(-0.318,-2.635) 7(0.318,-2.635) 8(0.953,-2.635) 9(1.587,-2.635) 10(2.223,-2.635) 11(2.857,-2.635) 12(3.493,-2.635) 13(3.493,2.635) 14(2.857,2.635) 15(2.223,2.635) 16(1.587,2.635) 17(0.953,2.635) 18(0.318,2.635) 19(-0.318,2.635) 20(-0.953,2.635) 21(-1.587,2.635) 22(-2.223,2.635) 23(-2.857,2.635) 24(-3.493,2.635)
TSSOP20_L
  oval 1.4x0.35 smd: 1(-2.8,2.925) 2(-2.8,2.275) 3(-2.8,1.625) 4(-2.8,0.975) 5(-2.8,0.325) 6(-2.8,-0.325) 7(-2.8,-0.975) 8(-2.8,-1.625) 9(-2.8,-2.275) 10(-2.8,-2.925) 11(2.8,-2.925) 12(2.8,-2.275) 13(2.8,-1.625) 14(2.8,-0.975) 15(2.8,-0.325) 16(2.8,0.325) 17(2.8,0.975) 18(2.8,1.625) 19(2.8,2.275) 20(2.8,2.925)

## Nets
5V: C13.2 C14.2 C23.2 C24.2 CN1.2 ICP.1 R19.2 R34.2 U3.1 U4.20 UART.1
15V: C4.1 C5.2 C9.2 C10.2 C15.2 C16.2 L1.2 R1.1 R4.1 R5.1 R6.1 R8.2 R12.2 U2.7
GND: C1.2 C4.2 C6.2 C9.1 C10.1 C13.1 C14.1 C15.1 C16.1 C20.1 C23.1 C24.1 C26.1 C28.1 C30.1 C31.1 C32.1 C33.1 C34.1 CN1.3 D1.1 HOLD2.0 ICP.5 J1.2 NOREF#4.0 NOREF#6.0 NOREF#9.0 NOREF#20.0 NOREF#22.0 NOREF#26.0 NOREF#28.0 NOREF#33.0 NOREF#34.0 NOREF#38.0 NOREF#39.0 NOREF#48.0 NOREF#49.0 NOREF#51.0 NOREF#53.0 NOREF#54.0 NOREF#55.0 NOREF#59.0 NOREF#69.0 NOREF#70.0 NOREF#73.0 NOREF#75.0 NOREF#81.0 NOREF#87.0 NOREF#88.0 NOREF#94.0 NOREF#106.0 NOREF#108.0 NOREF#111.0 NOREF#112.0 NOREF#120.0 NTC.1 R2.2 R10.1 R17.1 R26.1 R27.1 R28.1 R32.2 R33.2 R38.2 R39.2 R40.2 U1.4 U1.5 U1.6 U1.7 U1.8 U1.9 U2.8 U3.2 U4.19 UART.4 VB2.1 VB2.2 VB2.3
PGND: C2.2 C3.1 C8.1 C12.1 C21.1 C22.1 C27.1 NOREF#2.0 NOREF#5.0 NOREF#7.0 NOREF#8.0 NOREF#15.0 NOREF#16.0 NOREF#18.0 NOREF#23.0 NOREF#24.0 NOREF#44.0 NOREF#47.0 NOREF#57.0 NOREF#58.0 NOREF#61.0 NOREF#64.0 NOREF#72.0 NOREF#74.0 NOREF#79.0 NOREF#80.0 NOREF#82.0 NOREF#90.0 NOREF#92.0 NOREF#97.0 NOREF#99.0 NOREF#101.0 NOREF#102.0 NOREF#105.0 NOREF#107.0 NOREF#110.0 NOREF#115.0 NOREF#117.0 NOREF#126.0 NOREF#128.0 R11.2 R18.2 R24.2 R26.2 R27.2 R29.1 R31.2 R33.1 VB3.1 VB3.2 VB3.3 VB5.1 VB5.2 VB5.3 VB7.1 VB7.2 VB7.3
VCC: C1.1 C2.1 C3.2 C6.1 C12.2 C22.2 NOREF#3.0 NOREF#12.0 NOREF#13.0 NOREF#19.0 NOREF#21.0 NOREF#25.0 NOREF#29.0 NOREF#30.0 NOREF#31.0 NOREF#32.0 NOREF#35.0 NOREF#36.0 NOREF#43.0 NOREF#46.0 NOREF#50.0 NOREF#52.0 NOREF#56.0 NOREF#60.0 NOREF#62.0 NOREF#63.0 NOREF#68.0 NOREF#77.0 NOREF#84.0 NOREF#93.0 NOREF#95.0 NOREF#96.0 NOREF#103.0 NOREF#109.0 NOREF#113.0 NOREF#114.0 NOREF#116.0 NOREF#121.0 NOREF#123.0 NOREF#124.0 NOREF#125.0 NOREF#127.0 P1.5 R15.2 U1.1 VB1.5 VB1.6 VB1.7 VB1.8 VB4.5 VB4.6 VB4.7 VB4.8 VB6.5 VB6.6 VB6.7 VB6.8
CW/CCW: J1.1 U4.1
EMFU: C32.2 R35.2 R38.1 U4.21
EMFV: C33.2 R36.2 R39.1 U4.22
EMFW: C34.2 R37.2 R40.1 U4.24
FG: J1.3 R25.2
ICPCK: ICP.2 U4.16
ICPCS: ICP.4 U4.13
ICPDA: ICP.3 R22.2 U4.17
NETC5_1: C5.1 R1.2 R2.1 U1.3
NETC7_2: C7.2 R3.1 R7.1 VB1.4
NETC8_2: C8.2 R9.1 R11.1 VB3.4
NETC11_1: C11.1 D4.2 U2.20
NETC17_1: C17.1 D3.2 U2.17
NETC18_2: C18.2 R13.1 R14.1 VB4.4
NETC19_1: C19.1 D2.2 U2.14
NETC21_2: C21.2 R16.1 R18.1 VB5.4
NETC25_2: C25.2 R20.1 R21.1 VB6.4
NETC27_2: C27.2 R23.1 R24.1 VB7.4
NETD1_2: D1.2 L1.1 U1.2
NETD2_1: D2.1 R4.2
NETD3_1: D3.1 R5.2
NETD4_1: D4.1 R6.2
NETD5_1: D5.1 R34.1
NETP1_1: NOREF#17.0 NOREF#27.0 NOREF#37.0 NOREF#41.0 NOREF#42.0 NOREF#45.0 NOREF#65.0 NOREF#67.0 NOREF#71.0 NOREF#78.0 NOREF#83.0 NOREF#86.0 NOREF#122.0 P1.1 VB2.5 VB2.6 VB2.7 VB2.8
NETR7_2: R7.2 U2.19
NETR8_1: R8.1 R10.2 VB2.4
NETR9_2: R9.2 U2.11
NETR12_1: R12.1 U3.3
NETR14_2: R14.2 U2.16
NETR16_2: R16.2 U2.10
NETR21_2: R21.2 U2.13
NETR23_2: R23.2 U2.9
NETR25_1: R25.1 U4.12
NRST: C31.2 D5.2 U4.18
NTC_AD: C26.2 NTC.2 R19.1 R22.1
OCP: C30.2 R31.1 U4.11
OPA0IN: C29.2 R28.2 U4.10
OPA0IP: C29.1 R29.2 U4.9
U: C7.1 C11.2 NOREF#10.0 NOREF#40.0 NOREF#89.0 NOREF#98.0 NOREF#119.0 P1.4 R3.2 R35.1 U2.18 VB1.1 VB1.2 VB1.3 VB3.5 VB3.6 VB3.7 VB3.8
UART_RX: U4.15 UART.3
UART_TX: U4.14 UART.2
UN: U2.4 U4.4
UP: U2.1 U4.3
V: C17.2 C18.1 NOREF.0 NOREF#14.0 NOREF#66.0 NOREF#104.0 NOREF#118.0 P1.3 R13.2 R36.1 U2.15 VB4.1 VB4.2 VB4.3 VB5.5 VB5.6 VB5.7 VB5.8
VDC_AD: C20.2 R15.1 R17.2 U4.23
VN: U2.5 U4.6
VP: U2.2 U4.5
VSP: CN1.1 R30.2
VSP_AD: C28.2 R30.1 R32.1 U4.2
W: C19.2 C25.1 NOREF#11.0 NOREF#76.0 NOREF#85.0 NOREF#91.0 NOREF#100.0 P1.2 R20.2 R37.1 U2.12 VB6.1 VB6.2 VB6.3 VB7.5 VB7.6 VB7.7 VB7.8
WN: U2.6 U4.8
WP: U2.3 U4.7

Pads without a net: HOLD1 0

## Via types
v1: diameter 0.6, hole 0.4, Top Layer to Bottom Layer, 1203 vias

## Routing (per net, layer and track width the routed paths; a pad name or vN(x,y) marks a point on that pad's centre or on a via; arc(x,y) is an arc through that point)
5V: length 102.5
  Top Layer w0.381: 75.2,47.38 75.44,47.63 77.16,47.63 77.56,48.02 ; 75.2,47.38 CN1.2 ; 75.2,47.38 77.03,47.38 ; 77.56,46.86 77.03,47.38 ; 77.56,46.86 77.56,47.38 ; 77.56,46.86 77.56,19.94 ; 77.03,47.38 77.56,47.38 ; R34.2 72.77,55.37 77.56,50.59 77.56,48.02 ; 77.56,47.38 77.56,48.02 ; 77.56,11.01 77.56,19.47 ; 77.56,11.01 UART.1 ; 77.56,11.01 77.56,10.5 76.58,9.53 ; 77.56,19.47 77.56,19.94 ; 77.56,19.47 76.07,20.96 ; 77.56,19.94 76.16,21.34 ICP.1 ; C23.2 65.29,28.48 65.09,28.69 U4.20
  Top Layer w0.508: U3.1 73,9.99 ; C24.2 65.29,25.42 v1(65.02,25.15) 64.64,24.77 R19.2 ; C13.2 C14.2 v1(73.17,13.57) v1(72.52,14.22) 71.5,15.24 71.5,16.13 67.18,20.45 v1(65.66,20.45)
  Top Layer w0.762: C24.2 C23.2
  Bottom Layer w0.508: UART.1 75.82,9.53 74.17,11.18 74.17,12.57 v1(73.17,13.57) v1(72.52,14.22) ; v1(65.66,20.45) 65.02,21.08 v1(65.02,25.15)
15V: length 100.2
  Top Layer w0.381: U2.7 52.54,28.28 53.86,29.61 C10.2
  Top Layer w0.508: C4.1 57.2,13.13 56.41,12.34 R1.1
  Top Layer w0.635: C9.2 53.78,29.93 C10.2
  Top Layer w0.762: v1(52.32,34.04) v1(52.32,33.27) v1(53.21,33.27) ; v1(52.32,34.04) 52.32,38.61 51.76,39.18 R6.1 R5.1 R4.1 44.72,39.92 R8.2 ; v1(52.32,34.04) 53.09,34.04 53.21,33.91 ; C4.1 60.63,17.65 68.33,17.65 69.15,16.83 C15.2 69.15,14.4 C16.2 68.85,12.61 R12.2 ; C4.1 56.13,14.22 ; C4.1 57.62,14.22 L1.2 ; 53.78,33.47 v1(53.21,34.04) 53.21,33.91 ; 55.5,14.22 56.13,14.22 ; 55.5,14.22 54.99,13.72 54.17,13.72 ; 55.5,14.22 v1(55.25,14.22) v1(54.1,14.22) v1(54.1,13.34) v1(55.25,13.34) 56.13,14.22 ; v1(53.21,33.27) 53.78,32.71 ; v1(53.21,33.27) 53.21,33.91 ; 53.78,32.71 C9.2 ; 53.78,32.71 53.78,33.34 53.21,33.91 ; C5.2 R1.1
  Bottom Layer w0.762: 54.99,13.72 54.23,13.72 54.1,13.84 v1(54.1,14.22) ; v1(54.1,14.22) v1(55.25,14.22) v1(55.25,13.34) v1(54.1,13.34) 52.32,15.11 52.32,16 ; v1(54.1,14.22) 52.32,16 ; v1(52.32,33.27) v1(52.32,34.04) v1(53.21,34.04) v1(53.21,33.27) v1(52.32,33.27) ; v1(52.32,33.27) 52.32,16
GND: length 380.6
  Top Layer w0.254: 38.74,54 38.74,51.82 39.24,51.31 50.04,51.31 54.23,47.12 60.45,47.12 61.85,45.72 61.85,45.23 R28.1
  Top Layer w0.381: U4.19 64.45,28.66 63.99,28.2 C23.1 ; C10.1 51.65,28.93 U2.8 ; 58.97,27.7 C26.1
  Top Layer w0.508: 71.63,26.53 71.87,26.53 ; NTC.1 31.61,12.01 32.32,11.3 32.39,11.3 33.78,9.91 43.1,9.91 C6.2
  Top Layer w0.762: v1(63.99,25.67) C24.1 C23.1 ; 59.18,10.03 v1(58.42,10.8) v1(57.53,11.68) ; 59.18,10.03 59.18,10.54 58.04,11.68 ; 59.18,10.03 59.31,9.91 ; 59.18,10.03 59.18,9.17 ; v1(53.87,5.72) 54.75,6.6 U1.4 ; U3.2 70.13,4.04 67.56,6.6 67.56,14.08 C16.1 67.25,14.4 C15.1 v1(65.1,16.13) 63.75,14.78 ; U1.7 U1.6 U1.5 51.45,6.6 v1(52.34,5.72) ; 59.18,9.17 59.31,9.3 59.31,9.91 ; 59.18,9.17 59.17,9.16 ; 59.18,9.17 59.18,9.16 59.17,9.16 ; v1(62.36,25.65) C31.1 63.88,26.4 ; C30.1 57.28,42.04 56.52,42.8 56.52,44.58 57.02,45.09 R33.2 ; 59.31,9.91 v1(59.31,10.8) v1(58.42,11.68) 58.04,11.68 ; C20.1 70.9,30.75 71.14,30.99 R40.2 ; U3.2 71.5,9.79 C13.1 C14.1 71.87,12.84 v1(71.63,13.08) v1(71.12,13.59) v1(70.61,14.1) ; v1(61.09,14.35) 61.52,14.78 63.75,14.78 ; v1(61.09,14.35) 63.33,14.35 ; v1(61.09,14.35) 61.09,14.99 v1(61.6,15.49) v1(62.61,15.49) v1(63.75,15.49) 63.75,14.78 ; v1(57.53,11.68) 58.04,11.68 ; v1(57.53,11.68) v1(57.53,10.8) 59.17,9.16 ; 63.33,14.35 63.75,14.78 ; 63.33,14.35 C4.2 ; R32.2 70.66,47.66 70.66,49.37 C28.1 ; 67.06,26.53 71.63,26.53 v1(71.63,21.46) 70.68,20.51 v1(70.68,19.56) 70.68,18.54 ; 53.36,11.54 R2.2 52.34,10.18 51.69,9.53 49.91,9.53 47.04,6.65 C6.2 ; v1(51.18,35.69) v1(51.18,33.78) v1(51.18,32.77) 51.18,32.45 C9.1 51.88,30.92 52.56,30.24 C10.1 ; v1(59.18,18.16) v1(58.55,17.53) v1(57.91,16.89) 56.9,15.88
  Top Layer w0.8: CN1.3 71.14,49.91 C28.1
  Bottom Layer w0.254: 49.4,56.37 49.66,56.62 50.32,56.62 ; 50.32,56.62 51.69,55.25 ; 50.32,56.62 50.67,56.62 ; 51.69,56.26 51.03,56.26 50.67,56.62 ; 50.67,56.62 51.31,56.62
  Bottom Layer w0.762: 70.61,15.88 71.88,17.15 ; 70.61,15.88 v1(70.61,18.54) ; 70.61,15.88 v1(70.61,14.1) v1(71.12,13.59) v1(71.63,13.08) ; 71.88,17.15 UART.4 ; 71.88,17.15 74.3,19.56 74.3,32.89 ; 50.6,55.68 49.91,56.37 20.32,56.37 ; 50.6,55.68 51.18,55.1 v1(51.18,34.8) v1(51.18,33.78) v1(51.18,32.77) 51.18,12.95 49.78,11.56 49.78,8.13 ; 50.6,55.68 20.83,55.68 ; 57.91,11.81 58.55,11.18 ; 57.91,11.81 54.23,8.13 49.78,8.13 ; 57.91,11.81 v1(61.6,15.49) 61.85,15.49 ; 74.3,32.89 74.3,33.53 ; 74.3,32.89 75.31,31.88 ; 74.3,33.53 75.95,31.88 ; 74.3,33.53 74.3,37.97 74.55,38.23 J1.2 ; v1(70.61,18.54) 65.79,18.54 63.98,20.35 63.98,25.65 v1(62.36,25.65) 61.72,25.65 58.8,28.58 ; v1(70.61,18.54) 70.61,20.57 ; 49.78,8.13 49.78,7.73 47.64,5.59 ; 61.85,15.49 v1(59.18,18.16) v1(58.55,17.53) v1(57.91,16.89) ; 61.85,15.49 v1(62.61,15.49) ; 71.25,44.83 56.77,44.83 56.52,44.58 56.52,43.69
  vias: v1(1.65,54.61) v1(1.65,53.72) v1(1.65,52.83) v1(1.65,51.94) v1(1.65,51.05) v1(2.54,55.5) v1(2.54,54.61) v1(2.54,53.72) v1(2.54,52.83) v1(2.54,51.94) v1(2.54,51.05) v1(3.43,56.39) v1(3.43,55.5) v1(3.43,54.61) v1(3.43,53.72) v1(3.43,52.83) v1(3.43,51.94) v1(3.43,51.05) v1(4.32,56.39) v1(4.32,55.5) v1(4.32,54.61) v1(4.32,53.72) v1(4.32,52.83) v1(4.32,51.94) v1(4.32,51.05) v1(5.21,56.39) v1(5.21,55.5) v1(5.21,54.61) v1(5.21,53.72) v1(5.21,52.83) v1(5.21,51.94) v1(5.21,51.05) v1(6.1,56.39) v1(6.1,55.5) v1(6.1,54.61) v1(6.1,53.72) v1(6.1,52.83) v1(6.99,56.39) v1(6.99,55.5) v1(6.99,54.61) v1(6.99,53.72) v1(7.87,56.39) v1(7.87,55.5) v1(7.87,54.61) v1(7.87,53.72) v1(8.76,56.39) v1(8.76,55.5) v1(8.76,54.61) v1(8.76,53.72) v1(8.76,52.83) v1(9.65,56.39) v1(9.65,55.5) v1(9.65,54.61) v1(9.65,53.72) v1(9.65,52.83) v1(9.65,51.94) v1(9.65,51.05) v1(10.54,56.39) v1(10.54,55.5) v1(10.54,54.61) v1(10.54,53.72) v1(10.54,52.83) v1(10.54,51.94) v1(10.54,51.05) v1(11.43,56.39) v1(11.43,55.5) v1(11.43,54.61) v1(11.43,53.72) v1(11.43,52.83) v1(11.43,51.94) v1(12.32,56.39) v1(12.32,55.5) v1(12.32,54.61) v1(12.32,53.72) v1(12.32,52.83) v1(13.21,56.39) v1(13.21,55.5) v1(13.21,54.61) v1(13.21,53.72) v1(14.1,56.39) v1(14.1,55.5) v1(14.1,54.61) v1(14.1,53.72) v1(14.99,56.39) v1(14.99,55.5) v1(14.99,54.61) v1(14.99,53.72) v1(15.88,56.39) v1(15.88,55.5) v1(15.88,54.61) v1(15.88,53.72) v1(16.76,56.39) v1(16.76,55.5) v1(16.76,54.61) v1(17.65,56.39) v1(17.65,55.5) v1(17.65,54.61) v1(18.54,56.39) v1(18.54,55.5) v1(18.54,54.61) v1(18.54,53.72) v1(19.43,56.39) v1(19.43,55.5) v1(19.43,54.61) v1(19.43,53.72) v1(20.32,56.39) v1(20.32,55.5) v1(20.32,54.61) v1(20.32,53.72) v1(20.32,52.83) v1(21.21,56.37) v1(21.21,55.5) v1(21.21,54.61) v1(21.21,53.72) v1(21.21,52.83) v1(22.1,56.37) v1(22.1,54.61) v1(22.1,53.72) v1(22.1,52.83) v1(22.99,56.37) v1(22.99,54.61) v1(22.99,53.72) v1(22.99,52.83) v1(23.88,56.37) v1(23.88,54.61) v1(23.88,53.72) v1(23.88,52.83) v1(23.88,51.94) v1(24.77,56.37) v1(24.77,54.61) v1(24.77,53.72) v1(24.77,52.83) v1(24.77,51.94) v1(25.65,54.61) v1(25.65,53.72) v1(25.65,52.83) v1(25.65,51.94) v1(26.54,54.61) v1(26.54,53.72) v1(26.54,52.83) v1(26.54,51.94) v1(27.43,54.61) v1(27.43,53.72) v1(27.43,52.83) v1(27.43,51.94) v1(28.32,54.61) v1(28.32,53.72) v1(28.32,52.83) v1(28.32,51.94) v1(29.21,54.61) v1(29.21,53.72) v1(29.21,52.83) v1(29.21,51.94) v1(30.1,54.61) v1(30.1,53.72) v1(30.1,52.83) v1(30.1,51.94) v1(30.99,54.61) v1(30.99,53.72) v1(30.99,52.83) v1(31.88,54.61) v1(31.88,53.72) v1(31.88,52.83) v1(32.77,54.61) v1(32.77,53.72) v1(32.77,52.83) v1(33.66,54.61) v1(33.66,53.72) v1(33.66,52.83) v1(34.54,54.61) v1(34.54,53.72) v1(34.54,52.83) v1(35.43,54.61) v1(35.43,53.72) v1(35.43,52.83) v1(36.32,54.61) v1(36.32,53.72) v1(36.32,52.83) v1(43.94,7.87) v1(43.94,6.6) v1(43.94,5.33) v1(44.32,12.19) v1(44.7,4.45) v1(44.96,9.65) v1(44.96,8.26) v1(45.47,13.21) v1(45.97,54.61) v1(45.97,53.72) v1(45.97,52.83) v1(46.1,4.45) v1(46.1,3.18) v1(46.23,12.19) v1(46.23,9.65) v1(46.23,8.26) v1(46.74,13.21) v1(46.86,54.61) v1(46.86,53.72) v1(46.86,52.83) v1(47.37,4.45) v1(47.37,3.18) v1(47.64,9.65) v1(47.64,8.26) v1(47.75,54.61) v1(47.75,53.72) v1(47.75,52.83) v1(47.75,12.19) v1(48.01,13.21) v1(48.64,54.61) v1(48.64,53.72) v1(48.64,52.83) v1(48.64,4.45) v1(48.64,3.18) v1(48.91,9.65) v1(48.91,8.26) v1(49.53,13.21) v1(50.44,9.14) v1(50.44,7.62) v1(51.18,14.22) v1(51.96,9.14) v1(51.96,7.75) v1(52.34,4.7) v1(52.34,3.68) v1(53.59,23.5) v1(53.59,22.1) v1(53.72,16.76) v1(53.87,4.7) v1(53.87,3.68) v1(54.48,22.35) v1(54.74,23.24) v1(54.86,17.91) v1(54.86,15.49) v1(55.63,23.5) v1(55.88,15.75) v1(56.01,19.05) v1(56.52,45.21) v1(56.52,44.32) v1(56.52,43.31) v1(56.52,42.29) v1(56.64,17.15) v1(57.15,20.19) v1(57.4,24) v1(57.91,25.02) v1(58.42,18.8) v1(58.93,30.99) v1(58.93,29.59) v1(60.07,29.97) v1(60.07,28.83) v1(60.45,19.18) v1(60.71,20.7) v1(61.09,12.95) v1(61.6,16.51) v1(61.85,23.88) v1(62.23,20.7) v1(62.23,19.18) v1(62.36,13.08) v1(62.61,16.51) v1(62.61,11.56) v1(63.5,13.08) v1(63.75,23.88) v1(63.75,19.18) v1(63.75,16.51) v1(63.88,20.7) v1(64.01,10.8) v1(65.15,12.19) v1(65.28,9.91) v1(65.53,14.48) v1(66.17,11.05) v1(66.68,19.05) v1(67.56,34.54) v1(67.82,31.5) v1(67.82,30.73) v1(67.82,24.64) v1(68.71,33.78) v1(68.71,31.62) v1(68.71,30.73) v1(68.83,25.4) v1(68.96,20.83) v1(69.22,19.81) v1(70.23,20.83) v1(70.49,21.84) v1(71.14,33.15) v1(71.14,31.5) v1(71.5,1.02) v1(71.63,24.38) v1(71.63,22.86) v1(71.76,19.18) v1(73.03,1.02) v1(74.55,1.02) v1(75.95,6.6) v1(75.95,5.21) v1(75.95,3.68) v1(75.95,2.29)
PGND: length 54.8
  Top Layer w0.254: v1(62.48,46.36) 62.87,45.97 62.87,45.23 R29.1 ; R27.2 38.74,50.29 39.24,50.8 49.78,50.8 54.23,46.36 v1(58.8,46.36) 59.2,45.96 R33.1 R31.2
  Top Layer w0.508: v1(39.62,33.4) R24.2 39.51,33.91 VB7.2 ; 35.56,13.84 35.56,16.38 ; VB5.2 39.51,24.51 R18.2 ; VB7.1 VB7.3 ; VB5.1 VB5.3 ; R11.2 39.26,15.11 35.56,15.11
  Top Layer w0.762: 39.62,24.51 R18.2
  Bottom Layer w0.254: v1(58.8,46.36) v1(62.48,46.36)
  Bottom Layer w0.762: 38.74,43.69 38.74,45.97
  vias: v1(1.52,6.6) v1(1.52,5.72) v1(1.52,4.83) v1(1.52,3.94) v1(1.52,3.05) v1(1.52,2.16) v1(2.41,6.6) v1(2.41,5.72) v1(2.41,4.83) v1(2.41,3.94) v1(2.41,3.05) v1(2.41,2.16) v1(2.41,1.27) v1(3.3,6.6) v1(3.3,5.72) v1(3.3,4.83) v1(3.3,3.94) v1(3.3,3.05) v1(3.3,2.16) v1(3.3,1.27) v1(4.19,6.6) v1(4.19,5.72) v1(4.19,4.83) v1(4.19,3.94) v1(4.19,3.05) v1(4.19,2.16) v1(4.19,1.27) v1(5.08,6.6) v1(5.08,5.72) v1(5.08,4.83) v1(5.08,3.94) v1(5.08,3.05) v1(5.08,2.16) v1(5.08,1.27) v1(5.97,6.6) v1(5.97,5.72) v1(5.97,4.83) v1(5.97,3.94) v1(5.97,3.05) v1(5.97,2.16) v1(5.97,1.27) v1(6.86,3.94) v1(6.86,3.05) v1(6.86,2.16) v1(6.86,1.27) v1(7.75,3.94) v1(7.75,3.05) v1(7.75,2.16) v1(7.75,1.27) v1(8.64,3.94) v1(8.64,3.05) v1(8.64,2.16) v1(20.45,40.26) v1(20.45,31.12) v1(20.57,21.46) v1(21.21,40.26) v1(21.46,31.12) v1(21.46,21.46) v1(30.35,49.02) v1(30.35,48.13) v1(30.35,47.24) v1(30.35,46.36) v1(30.35,45.47) v1(30.35,44.58) v1(30.35,43.69) v1(30.35,42.8) v1(31.24,49.91) v1(31.24,49.02) v1(31.24,48.13) v1(31.24,47.24) v1(31.24,46.36) v1(31.24,45.47) v1(31.24,44.58) v1(31.24,43.69) v1(31.24,42.8) v1(32.13,49.91) v1(32.13,49.02) v1(32.13,48.13) v1(32.13,47.24) v1(32.13,46.36) v1(32.13,45.47) v1(32.13,44.58) v1(32.13,43.69) v1(32.13,42.8) v1(33.02,49.91) v1(33.02,49.02) v1(33.02,48.13) v1(33.02,47.24) v1(33.02,46.36) v1(33.02,45.47) v1(33.02,44.58) v1(33.02,43.69) v1(33.02,42.8) v1(33.91,49.91) v1(33.91,49.02) v1(33.91,48.13) v1(33.91,47.24) v1(33.91,46.36) v1(33.91,45.47) v1(33.91,44.58) v1(33.91,43.69) v1(33.91,42.8) v1(34.8,49.91) v1(34.8,49.02) v1(34.8,48.13) v1(34.8,47.24) v1(34.8,46.36) v1(34.8,45.47) v1(34.8,44.58) v1(34.8,43.69) v1(34.8,42.8) v1(35.18,31.75) v1(35.18,22.35) v1(35.18,12.45) v1(35.18,11.68) v1(35.56,15.75) v1(35.56,14.48) v1(35.69,49.91) v1(35.69,49.02) v1(35.69,48.13) v1(35.69,47.24) v1(35.69,46.36) v1(35.69,45.47) v1(35.69,44.58) v1(35.69,43.69) v1(35.69,42.8) v1(35.81,34.54) v1(35.81,33.27) v1(35.81,25.15) v1(35.81,23.88) v1(36.07,31.75) v1(36.07,22.35) v1(36.07,12.45) v1(36.07,11.68) v1(36.58,49.91) v1(36.58,49.02) v1(36.58,48.13) v1(36.58,47.24) v1(36.58,46.36) v1(36.58,45.47) v1(36.58,44.58) v1(36.58,43.69) v1(36.58,42.8) v1(36.96,31.75) v1(36.96,22.35) v1(36.96,13.34) v1(36.96,12.45) v1(36.96,11.68) v1(37.47,49.91) v1(37.47,46.36) v1(37.47,45.47) v1(37.47,44.58) v1(37.47,43.69) v1(37.47,42.8) v1(37.85,33.4) v1(37.85,32.51) v1(37.85,31.75) v1(37.85,23.24) v1(37.85,22.35) v1(37.85,14.22) v1(37.85,13.34) v1(37.85,12.45) v1(37.85,11.68) v1(38.35,49.91) v1(38.35,46.36) v1(38.35,45.47) v1(38.35,44.58) v1(38.35,43.69) v1(38.35,42.8) v1(38.74,33.4) v1(38.74,32.51) v1(38.74,31.75) v1(38.74,24.64) v1(38.74,23.24) v1(38.74,22.35) v1(38.74,14.22) v1(38.74,13.34) v1(38.74,12.45) v1(38.74,11.68) v1(39.24,49.91) v1(39.24,46.36) v1(39.24,45.47) v1(39.24,44.58) v1(39.24,43.69) v1(39.24,42.8) v1(39.62,32.51) v1(39.62,31.75) v1(39.62,23.24) v1(39.62,14.22) v1(39.62,13.34) v1(39.62,12.45) v1(39.62,11.68) v1(39.68,22.35) v1(40.13,49.91) v1(40.13,46.36) v1(40.13,45.47) v1(40.13,44.58) v1(40.13,43.69) v1(40.13,42.8) v1(40.51,34.29) v1(40.51,33.4) v1(40.51,32.51) v1(40.51,31.75) v1(40.51,24.89) v1(40.51,24) v1(40.51,23.11) v1(40.51,22.35) v1(40.51,15.11) v1(40.51,14.22) v1(40.51,13.34) v1(40.51,12.45) v1(40.51,11.68) v1(41.02,49.91) v1(41.02,49.02) v1(41.02,48.13) v1(41.02,47.24) v1(41.02,46.36) v1(41.02,45.47) v1(41.02,44.58) v1(41.02,43.69) v1(41.02,42.8) v1(41.4,34.29) v1(41.4,33.4) v1(41.4,32.51) v1(41.4,24.89) v1(41.4,24) v1(41.4,23.11) v1(41.4,15.11) v1(41.4,14.22) v1(41.4,13.34) v1(41.4,12.45) v1(41.91,49.91) v1(41.91,46.36) v1(41.91,45.47) v1(41.91,44.58) v1(41.91,43.69) v1(41.91,42.8) v1(42.8,49.91) v1(42.8,46.36) v1(42.8,45.47) v1(42.8,44.58) v1(42.8,43.69) v1(42.8,42.8) v1(43.69,49.91) v1(43.69,46.36) v1(43.69,45.47) v1(43.69,44.58) v1(43.69,43.69) v1(43.69,42.8) v1(44.58,49.91) v1(44.58,46.36) v1(44.58,45.47) v1(44.58,44.58) v1(44.58,43.69) v1(44.58,42.8) v1(45.47,49.91) v1(45.47,49.02) v1(45.47,48.13) v1(45.47,47.24) v1(45.47,46.36) v1(45.47,45.47) v1(45.47,44.58) v1(45.47,43.69) v1(45.47,42.8) v1(46.36,49.91) v1(46.36,49.02) v1(46.36,48.13) v1(46.36,47.24) v1(46.36,46.36) v1(46.36,45.47) v1(46.36,44.58) v1(46.36,43.69) v1(46.36,42.8) v1(47.24,49.91) v1(47.24,49.02) v1(47.24,48.13) v1(47.24,47.24) v1(47.24,46.36) v1(47.24,45.47) v1(47.24,44.58) v1(47.24,43.69) v1(47.24,42.8) v1(48.13,49.91) v1(48.13,49.02) v1(48.13,48.13) v1(48.13,47.24) v1(48.13,46.36) v1(48.13,45.47) v1(48.13,44.58) v1(48.13,43.69) v1(48.13,42.8)
VCC: length 92.3
  Top Layer w0.508: 18.61,38.48 17.38,37.26 17.38,34.56 18.61,33.33 18.61,29.08 17.38,27.86 17.38,25.16 18.61,23.93 18.61,19.69 18,19.08 ; v1(11.43,14.73) 11.05,15.11 P1.5
  Top Layer w0.635: 54.48,1.52 U1.1
  Top Layer w0.762: 57.85,1.52 40.89,1.52 37.04,5.38 C6.1 35.39,4.32 13.74,4.32 C2.1 ; R15.2 58.11,2.03 58.23,1.91
  vias: v1(1.27,48.51) v1(1.27,47.63) v1(1.27,46.74) v1(1.27,45.85) v1(1.65,18.29) v1(1.65,17.4) v1(1.65,16.51) v1(1.65,15.62) v1(1.65,14.73) v1(1.65,13.84) v1(1.65,12.95) v1(1.65,12.07) v1(1.65,11.18) v1(1.65,10.29) v1(2.16,48.51) v1(2.16,47.63) v1(2.16,46.74) v1(2.16,45.85) v1(2.54,19.18) v1(2.54,18.29) v1(2.54,17.4) v1(2.54,16.51) v1(2.54,15.62) v1(2.54,14.73) v1(2.54,13.84) v1(2.54,12.95) v1(2.54,12.07) v1(2.54,11.18) v1(2.54,10.29) v1(3.05,48.51) v1(3.05,47.63) v1(3.05,46.74) v1(3.05,45.85) v1(3.43,19.18) v1(3.43,18.29) v1(3.43,17.4) v1(3.43,16.51) v1(3.43,15.62) v1(3.43,14.73) v1(3.43,13.84) v1(3.43,12.95) v1(3.43,12.07) v1(3.43,11.18) v1(3.43,10.29) v1(3.94,48.51) v1(3.94,47.63) v1(3.94,46.74) v1(3.94,45.85) v1(4.32,19.18) v1(4.32,18.29) v1(4.32,17.4) v1(4.32,16.51) v1(4.32,15.62) v1(4.32,14.73) v1(4.32,13.84) v1(4.32,12.95) v1(4.32,12.07) v1(4.32,11.18) v1(4.32,10.29) v1(4.83,48.51) v1(4.83,47.63) v1(4.83,46.74) v1(4.83,45.85) v1(5.21,19.18) v1(5.21,18.29) v1(5.21,17.4) v1(5.21,16.51) v1(5.21,15.62) v1(5.21,14.73) v1(5.21,13.84) v1(5.21,12.95) v1(5.21,12.07) v1(5.21,11.18) v1(5.21,10.29) v1(5.72,48.51) v1(5.72,47.63) v1(5.72,46.74) v1(5.72,45.85) v1(6.1,19.18) v1(6.1,18.29) v1(6.1,17.4) v1(6.1,16.51) v1(6.1,15.62) v1(6.1,14.73) v1(6.1,13.84) v1(6.1,12.95) v1(6.6,48.51) v1(6.99,19.18) v1(6.99,18.29) v1(6.99,17.4) v1(6.99,16.51) v1(6.99,15.62) v1(6.99,14.73) v1(6.99,13.84) v1(6.99,12.95) v1(7.49,48.51) v1(7.87,19.18) v1(7.87,18.29) v1(7.87,17.4) v1(7.87,16.51) v1(7.87,15.62) v1(7.87,14.73) v1(7.87,13.84) v1(7.87,12.95) v1(8.38,48.51) v1(8.76,19.18) v1(8.76,18.29) v1(8.76,17.4) v1(8.76,16.51) v1(8.76,15.62) v1(8.76,14.73) v1(8.76,13.84) v1(8.76,12.95) v1(9.02,47.88) v1(9.02,46.99) v1(9.02,46.1) v1(9.65,16.51) v1(9.65,15.62) v1(9.65,14.73) v1(9.65,13.84) v1(9.65,12.95) v1(9.65,12.07) v1(9.65,11.18) v1(9.65,10.29) v1(10.54,15.62) v1(10.54,14.73) v1(10.54,13.84) v1(10.54,12.95) v1(10.54,12.07) v1(10.54,11.18) v1(10.54,10.29) v1(11.43,15.62) v1(11.43,13.84) v1(11.43,12.95) v1(11.43,12.07) v1(11.43,11.18) v1(11.43,10.29) v1(12.32,15.62) v1(12.32,14.73) v1(12.32,13.84) v1(12.32,12.95) v1(12.32,12.07) v1(12.32,11.18) v1(12.32,10.29) v1(13.21,12.07) v1(13.21,11.18) v1(13.21,10.29)
CW/CCW: length 14.7
  Top Layer w0.254: 73.03,38.99 73.28,38.99 76.07,36.2 76.07,35.94 ; 73.03,38.99 68.29,38.99 U4.1 ; 73.03,38.99 76.07,35.94 ; J1.1 76.07,35.94
EMFU: length 41.6
  Top Layer w0.254: v1(66.04,21.59) 57.4,21.59 50.29,14.48 45.97,14.48 45.09,15.37 R35.2 ; 68.33,28.08 68.45,27.96 ; 68.45,27.96 68.45,28.07 67.82,28.7 66.55,28.7 65.72,29.53 U4.21 ; 68.45,27.96 68.45,27.83 ; 68.45,27.96 68.58,27.83 ; 66.93,27.96 67.06,27.83
  Top Layer w0.762: 68.45,27.83 66.8,27.83
  Bottom Layer w0.254: v1(66.04,21.59) 66.93,22.48 66.93,27.18 v1(67.56,27.81)
EMFV: length 40.8
  Top Layer w0.254: U4.22 66.36,29.78 66.93,29.21 68.45,29.21 69.84,27.83 70.1,27.83 ; v1(68.58,22.31) 56.98,22.31 49.91,15.24 48.13,15.24 47.24,16.13 R36.2
  Top Layer w0.762: 70.22,27.83 71.63,27.83
  Bottom Layer w0.254: v1(70.99,27.81) 70.99,24.72 v1(68.58,22.31)
EMFW: length 36.8
  Top Layer w0.254: R37.2 50.1,16.58 56.52,22.99 v1(67.82,22.99) ; 67.72,33.15 U4.24 68.29,32.39 69.58,32.39 69.84,32.64 70.09,32.64
  Top Layer w0.762: R40.1 v1(69.84,33.21) C34.2
  Bottom Layer w0.254: v1(67.82,22.99) 69.84,25 v1(69.84,33.21)
FG: length 7.7
  Top Layer w0.254: 75.82,40.51 73.68,40.51 R25.2 ; R25.2 J1.3 ; R25.2 73.68,41.02 75.82,41.02
ICPCK: length 36.5
  Top Layer w0.254: v1(71.5,37.21) 71.5,37.14 73.28,35.36 73.28,30.35 74.17,29.46 74.17,26.04 ; 74.17,26.04 74.17,25.78 ICP.2 ; 74.17,26.04 76.07,24.13 ; v1(62.18,29.67) 62.18,31.66 62.55,32.02 U4.16
  Bottom Layer w0.254: v1(62.18,29.67) 62.18,34.12 64.01,35.94 70.31,35.94 71.5,37.14 v1(71.5,37.21)
ICPCS: length 31.5
  Top Layer w0.254: 74.3,31.12 74.3,36.2 v1(73.28,37.21) ; 74.3,31.12 74.3,31.24 ; 74.3,31.12 74.3,30.86 76.07,29.08 76.07,28.96 ; 74.3,31.12 76.07,29.34 ; U4.13 60.07,32.48 v1(60.07,31.75)
  Bottom Layer w0.254: v1(60.07,31.75) 60.07,34.75 62.78,37.47 68.96,37.47 69.47,37.97 72.59,37.97 73.28,37.29 v1(73.28,37.21)
ICPDA: length 35.4
  Top Layer w0.254: U4.17 63.18,31.94 62.87,31.62 v1(62.87,30.61) 62.87,29.08 62.36,28.58 61.34,28.58 60.58,27.81 R22.2 ; 74.68,28.07 74.68,27.81 ICP.3 ; 74.68,28.07 76.07,26.67 ; 74.68,28.07 74.68,29.72 73.79,30.61 73.79,35.74 72.39,37.14 v1(72.39,37.21)
  Bottom Layer w0.254: v1(62.87,30.61) 62.87,33.66 64.64,35.43 70.69,35.43 72.39,37.14 v1(72.39,37.21)
NETC5_1: length 8.1
  Top Layer w0.508: U1.3 56.79,5.33 57.17,5.72 57.17,8.11 R1.2 C5.1 R2.1
NETC7_2: length 5.8
  Top Layer w0.508: VB1.4 22.97,17.65 C7.2 ; R7.1 23.18,17.86 C7.2 ; C7.2 R3.1
NETC8_2: length 6.3
  Top Layer w0.508: R11.1 C8.2 37.85,18.6 36.9,17.65 35.56,17.65
NETC11_1: length 13.1
  Top Layer w0.381: D4.2 49.45,32.56 48.39,31.5 48.39,26.42 46.35,24.38 U2.20 45.09,24.12 C11.1
NETC17_1: length 12.4
  Top Layer w0.381: U2.17 46.4,26.33 47.63,27.56 D3.2 ; C17.1 47.12,22.79 v1(47.12,23.88)
  Bottom Layer w0.381: v1(47.12,23.88) 47.12,25.78 v1(46.48,26.42)
NETC18_2: length 5.8
  Top Layer w0.508: VB4.4 22.97,27.05 C18.2 ; C18.2 R13.1 ; C18.2 23.18,27.26 R14.1
NETC19_1: length 14
  Top Layer w0.381: D2.2 45.47,31.75 46.86,30.35 46.86,28.7 46.44,28.28 U2.14 ; C19.1 49.15,22.92 49.15,23.62 v1(48.9,23.88)
  Bottom Layer w0.381: v1(46.36,28.32) 47.12,28.32 48.64,26.8 48.64,24.13 v1(48.9,23.88)
NETC21_2: length 6.1
  Top Layer w0.508: VB5.4 37.15,27.05 37.91,27.81 37.91,25.99 C21.2 R18.1
NETC25_2: length 5.8
  Top Layer w0.508: VB6.4 22.97,36.45 C25.2 ; C25.2 R20.1 ; C25.2 23.18,36.66 R21.1
NETC27_2: length 6.1
  Top Layer w0.508: R24.1 C27.2 37.91,35.39 37.91,37.21 37.15,36.45 VB7.4
NETD1_2: length 7.7
  Top Layer w0.508: U1.2 59.06,4.06
  Top Layer w0.762: 59.37,4.37 L1.1
NETD2_1: length 1.8
  Top Layer w0.762: D2.1 R4.2
NETD3_1: length 1.8
  Top Layer w0.762: D3.1 R5.2
NETD4_1: length 1.8
  Top Layer w0.762: D4.1 R6.2
NETD5_1: length 2.2
  Top Layer w0.254: D5.1 70.72,55.25 R34.1
NETP1_1:
  vias: v1(1.27,40.13) v1(1.27,39.24) v1(1.27,38.35) v1(2.16,40.13) v1(2.16,39.24) v1(2.16,38.35) v1(2.16,37.47) v1(3.05,40.13) v1(3.05,39.24) v1(3.05,38.35) v1(3.05,37.47) v1(3.94,40.13) v1(3.94,39.24) v1(3.94,38.35) v1(3.94,37.47) v1(4.83,40.13) v1(4.83,39.24) v1(4.83,38.35) v1(4.83,37.47) v1(5.72,40.13) v1(5.72,39.24) v1(5.72,38.35) v1(5.72,37.47) v1(6.6,40.13) v1(6.6,39.24) v1(6.6,38.35) v1(6.6,37.47) v1(7.49,40.13) v1(7.49,39.24) v1(7.49,38.35) v1(7.49,37.47) v1(8.38,40.13) v1(8.38,39.24) v1(8.38,38.35) v1(8.38,37.47) v1(9.27,40.13) v1(9.27,37.47) v1(13.21,50.29) v1(13.21,49.4) v1(13.21,48.51) v1(14.1,50.29) v1(14.1,49.4) v1(14.1,48.51) v1(14.1,47.63) v1(14.99,50.29) v1(14.99,49.4) v1(14.99,48.51) v1(14.99,47.63) v1(14.99,46.74) v1(15.88,50.29) v1(15.88,49.4) v1(15.88,48.51) v1(15.88,47.63) v1(15.88,46.74) v1(15.88,45.85) v1(16.76,50.29) v1(16.76,49.4) v1(16.76,48.51) v1(16.76,47.63) v1(16.76,46.74) v1(16.76,45.85) v1(16.76,44.96) v1(17.65,49.4) v1(17.65,48.51) v1(17.65,47.63) v1(17.65,46.74) v1(17.65,45.85) v1(17.65,44.96) v1(17.65,44.07) v1(18.54,44.07) v1(18.54,43.18) v1(19.43,44.07) v1(19.43,43.18) v1(19.43,42.29) v1(20.32,44.07) v1(20.32,43.18) v1(20.32,42.29) v1(21.21,44.07) v1(21.21,43.18) v1(21.21,42.29) v1(22.1,44.07) v1(22.1,43.18) v1(22.1,42.29) v1(22.99,44.07) v1(22.99,43.18) v1(22.99,42.29) v1(23.88,48.51) v1(23.88,47.63) v1(23.88,46.74) v1(23.88,45.85) v1(23.88,44.96) v1(23.88,44.07) v1(23.88,43.18) v1(23.88,42.29) v1(24.77,48.51) v1(24.77,47.63) v1(24.77,46.74) v1(24.77,45.85) v1(24.77,44.96) v1(24.77,44.07) v1(24.77,43.18) v1(24.77,42.29) v1(25.65,48.51) v1(25.65,47.63) v1(25.65,46.74) v1(25.65,45.85) v1(25.65,44.96) v1(25.65,44.07) v1(25.65,43.18) v1(25.65,42.29) v1(26.54,48.51) v1(26.54,47.63) v1(26.54,46.74) v1(26.54,45.85) v1(26.54,44.96) v1(26.54,44.07) v1(26.54,43.18) v1(26.54,42.29) v1(27.43,48.51) v1(27.43,47.63) v1(27.43,46.74) v1(27.43,45.85) v1(27.43,44.96) v1(27.43,44.07) v1(27.43,43.18) v1(27.43,42.29)
NETR7_2: length 23.2
  Top Layer w0.381: 43.95,25.03 44.83,25.03
  Top Layer w0.406: 43.56,24.64 43.95,25.03
  Top Layer w0.508: R7.2 26.35,20.96 42.04,20.96 42.8,21.72 42.8,23.88 43.56,24.64
NETR8_1: length 38.2
  Top Layer w0.508: v1(28.83,41.78) 29.59,41.02 43.05,41.02 ; VB2.4 18.54,51.82 v1(16.38,51.82)
  Bottom Layer w0.508: v1(28.83,41.78) 28.83,49.28 27.43,50.67 19.81,50.67 18.67,51.82 v1(16.38,51.82)
NETR9_2: length 16.9
  Top Layer w0.381: v1(44.96,30.99) 44.96,30.36 U2.11
  Top Layer w0.508: v1(42.42,18.67) 42.16,18.42 R9.2
  Bottom Layer w0.381: v1(42.42,18.67) 42.42,25.91 43.56,27.05 43.56,29.59 v1(44.96,30.99)
NETR12_1: length 2.6
  Top Layer w0.508: U3.3 70,8.61 R12.1
NETR14_2: length 25.4
  Top Layer w0.381: v1(42.67,27.31) 43,26.98 U2.16
  Top Layer w0.508: R14.2 26.35,30.35 41.28,30.35 v1(42.67,31.75)
  Bottom Layer w0.381: v1(42.67,27.31) v1(42.67,31.75)
